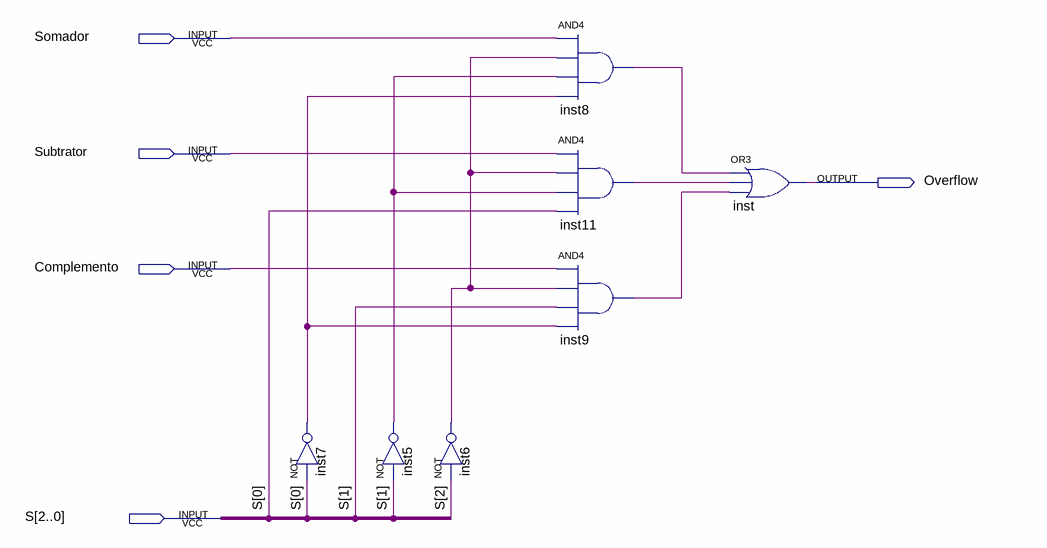
[diagram p0: schematic sheet]
// Quartus schematic MuxOver.bdf as structural Verilog: 7 symbols, 5 pins
module MuxOver (
  input  Somador,
  input  Subtrator,
  input  Complemento,
  input  [2:0] S,
  output Overflow
);

  wire inst5_out, inst6_out, inst7_out, inst8_out, inst9_out, inst11_out;

  not inst7 (inst7_out, S[0]);
  not inst5 (inst5_out, S[1]);
  not inst6 (inst6_out, S[2]);
  and inst8 (inst8_out, Somador, inst6_out, inst5_out, inst7_out);
  and inst11 (inst11_out, Subtrator, inst6_out, inst5_out, S[0]);
  and inst9 (inst9_out, Complemento, inst6_out, S[1], inst7_out);
  or inst (Overflow, inst8_out, inst11_out, inst9_out);
endmodule
